# EAGLE design i2c (EAGLE 6.1)
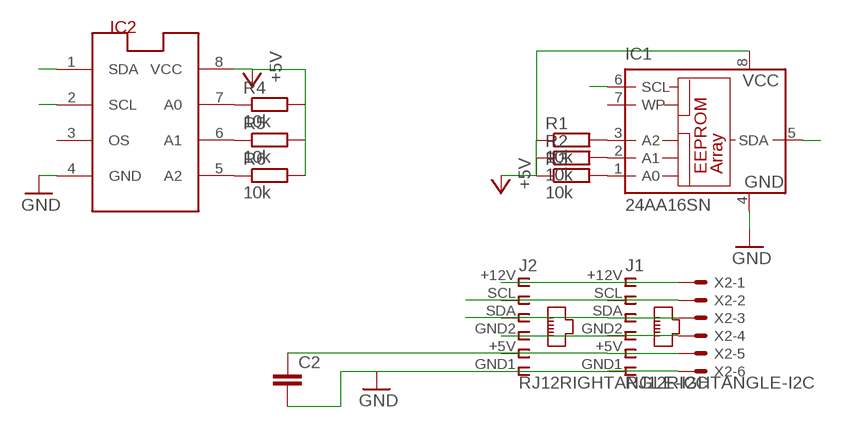
[diagram p0: schematic, sheet 1]

## Parts
C2  C-EUC1206  [C1206]
IC1  24AA16SN  [SO-08]
IC2  LM75_ICN  [SO8_LM75]
J1  RJ12RIGHTANGLE-I2C  [RJ12-RIGHTANGLE-I2C]
J2  RJ12RIGHTANGLE-I2C  [RJ12-RIGHTANGLE-I2C]
R1  10k  R-EU_M1206  [M1206]
R2  10k  R-EU_M1206  [M1206]
R3  10k  R-EU_M1206  [M1206]
R4  10k  R-EU_M1206  [M1206]
R5  10k  R-EU_M1206  [M1206]
R6  10k  R-EU_M1206  [M1206]
X2  KK-156-6  [KK-156-6]

## Nets
+5V: IC1.8(VCC) IC2.8(VCC) R1.1 R2.1 R3.1 R4.2 R5.2 R6.2
GND: C2.2 IC1.4(GND) IC2.4(GND) J1.GND1 J2.GND1 X2.6
N$1: J1.+12V J2.+12V X2.1
N$2: IC1.1(A0) R3.2
N$3: J1.GND2 J2.GND2 X2.4
N$4: IC1.2(A1) R2.2
N$5: IC1.3(A2) R1.2
N$6: IC2.1(SDA)
N$7: IC2.2(SCL)
N$8: IC2.5(A2) R6.1
N$10: IC2.7(A0) R4.1
N$11: IC2.6(A1) R5.1
SCL: IC1.6(SCL) J1.SCL J2.SCL X2.2
SDA: IC1.5(SDA) J1.SDA J2.SDA X2.3
VCC: C2.1 J1.+5V J2.+5V X2.5
Unconnected: IC1.7(WP) IC2.3(OS)

## Library data of the parts
C2 = rcl:C-EU: CAPACITOR, European symbol
IC1 = microchip:24*: Serial EEPROM I2C; MF: MICROCHIP; MPN: 24AA16-I/SN; OC_FARNELL: 1331289; OC_NEWARK: 96K4056
IC2 = lm75:LM75_IC: Temperatursensor
J1 J2 = lpatiny:RJ12: CORCOM Modular RJ Jacks No Shield Source: www.tycoelectronics.com .. ENG_DS_1654001_1099_RJ_L_0507.pdf
R1-R6 = resistor:R-EU_: RESISTOR, European symbol
X2 = con-molex:KK-156-6: KK 156 HEADER Source: http://www.molex.com/pdm_docs/sd/026604100_sd.pdf; OC_FARNELL: unknown; OC_NEWARK: unknown

## Net classes
0 default: width 0.508 mm

## Board
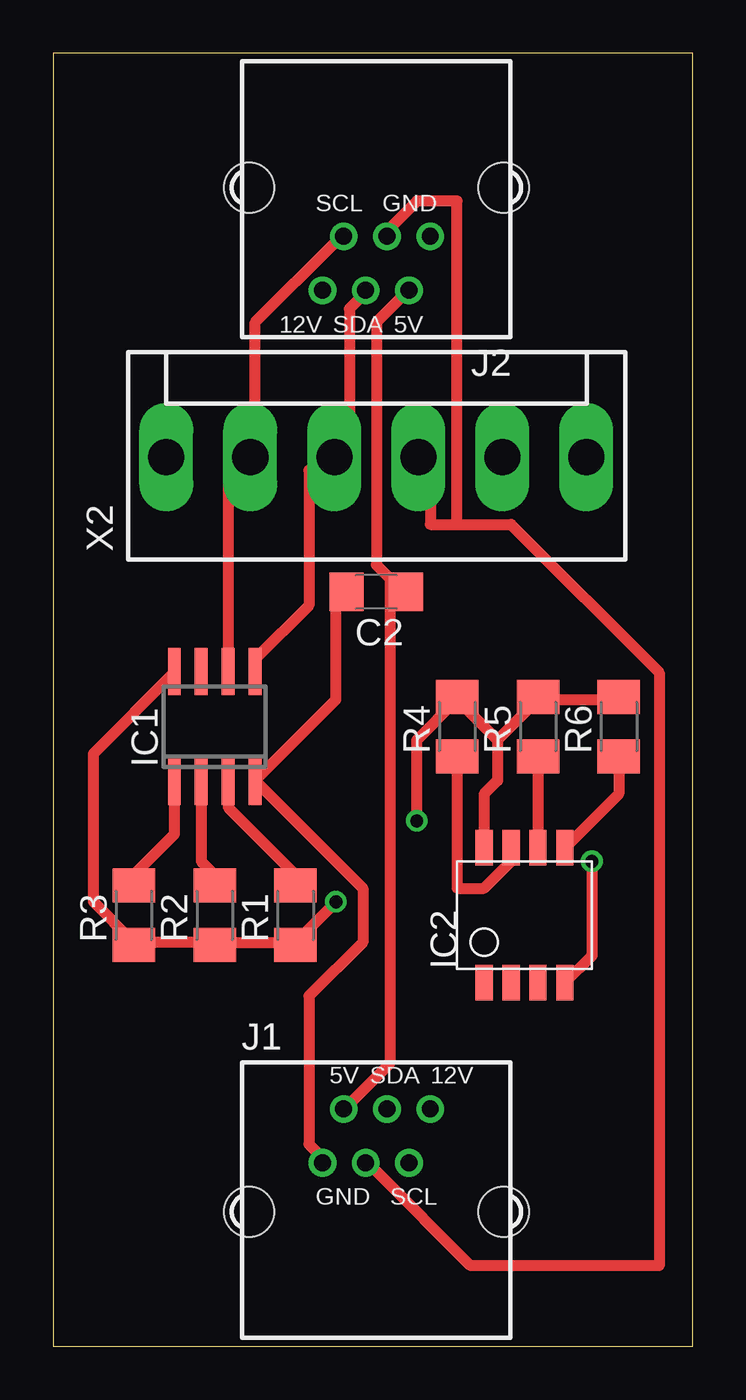
[diagram p1: board, top side]
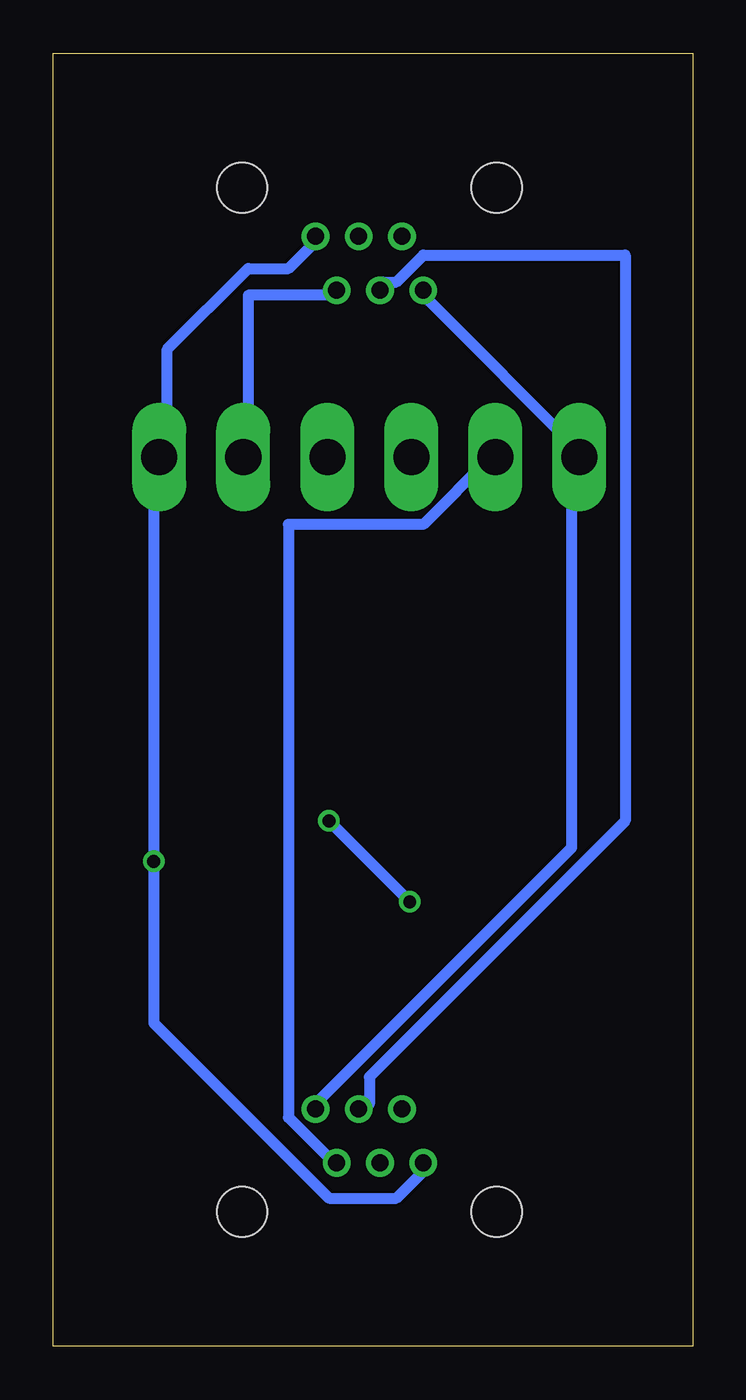
[diagram p2: board, bottom side, seen from below]

Size 30.15 x 60.95 mm. Coordinates in mm from the lower left corner, seen from the top.
Outline: 0,0 30.15,0 30.15,60.95 0,60.95 0,0
Copper layers (1*16): Top 0.035mm / dielectric 1.5mm / Bottom 0.035mm
Design rules: minimum track width 10mil, minimum drill 24mil, track to track 8mil, track to pad 8mil, pad to pad 8mil, via to via 8mil, smd to smd 8mil, copper to edge 40mil, drill to drill 8mil, minimum pad ring 10mil, minimum via ring 8mil, stop-mask expansion 4mil, vias tented up to drill 0mil, thermal gap 10mil

### Footprints (pad centres in the part's own frame; a part is rotated, then mirrored left to right if it is on the bottom)
C1206 = smd 1.6 x 1.8: 1 -1.4,0; 2 1.4,0
SO-08 = smd 0.6 x 2.2: 1 -1.905,-2.6; 2 -0.635,-2.6; 3 0.635,-2.6; 4 1.905,-2.6; 5 1.905,2.6; 6 0.635,2.6; 7 -0.635,2.6; 8 -1.905,2.6
SO8_LM75 = smd 0.813 x 1.676: 1 -1.27,-3.175; 2 0,-3.175; 3 1.27,-3.175; 4 2.54,-3.175; 5 2.54,3.175; 6 1.27,3.175; 7 0,3.175; 8 -1.27,3.175
RJ12-RIGHTANGLE-I2C = drill 0.8 pad 1.3: +5V -1.54,4.84; +12V 2.54,4.84; GND1 -2.54,2.3; GND2 -0.5,2.3; SCL 1.54,2.3; SDA 0.5,4.84 | hole 2.36: -6,0; 6,0
M1206 = smd 1.6 x 2: 1 -1.4,0; 2 1.4,0
KK-156-6 = drill 1.7 pad 2.184 long: 1 -9.9,0; 2 -5.94,0; 3 -1.98,0; 4 1.98,0; 5 5.94,0; 6 9.9,0

### Placement (x,y rotation side)
C2  15.24,35.56 180 top
IC1  7.62,29.21 0 top
IC2  21.59,20.32 0 top
J1  15.24,6.35 0 top
J2  15.24,54.61 180 top
R1  11.43,20.32 90 top
R2  7.62,20.32 90 top
R3  3.81,20.32 90 top
R4  19.05,29.21 90 top
R5  22.86,29.21 90 top
R6  26.67,29.21 90 top
X2  15.24,41.91 0 top

### Tracks (layer width: path | path; a pad name or v marks a point on that pad's centre or on a via)
+5V  (via drill 0.61)
  Top 0.508: IC2.8 20.32,26.04 20.95,26.67 20.95,28.57 | 19.05,30.48 20.95,28.57 | 20.95,28.57 22.86,30.48 | 22.86,30.48 26.67,30.48 R6.2 | 22.86,30.48 R5.2 | 7.62,19.05 3.81,19.05 | 7.62,19.05 11.43,19.05 | 7.62,19.05 R2.1 | 3.81,19.05 1.91,20.95 1.91,27.94 5.71,31.75 IC1.8 | 3.81,19.05 R3.1 | 19.05,30.48 17.14,28.57 v17.14,24.77 | 11.43,19.05 v13.34,20.95 | 19.05,30.48 R4.2 | 11.43,19.05 R1.1
  Bottom 0.508: v13.34,20.95 v17.14,24.77
GND  (via drill 0.61)
  Top 0.508: 9.53,26.67 13.34,30.48 13.34,35.56 C2.2 | 9.53,26.67 14.61,21.59 14.61,19.05 12.06,16.51 12.06,9.53 12.7,8.89 J1.GND1 | 9.53,26.67 IC1.4 | IC2.4 25.4,18.41 v25.4,22.86
  Bottom 0.508: J2.GND1 17.78,52.07 19.05,50.8 20.95,50.8 24.77,46.99 24.77,41.91 X2.6 25.4,41.91 v25.4,22.86 25.4,15.24 17.14,6.99 13.97,6.99 12.7,8.26 J1.GND1
N$1
  Bottom 0.508: J1.+12V 17.78,11.43 5.71,23.5 5.71,41.91 X2.1 5.08,41.91 12.7,49.53 J2.+12V
N$2
  Top 0.508: IC1.1 5.71,24.13 3.81,22.23 R3.2
N$3
  Top 0.508: 19.05,38.73 17.78,38.73 17.78,41.91 X2.4 | 19.05,38.73 21.59,38.73 28.57,31.75 28.57,3.81 19.68,3.81 15.24,8.26 J1.GND2 | 19.05,38.73 19.05,53.98 17.14,53.98 15.88,52.7 J2.GND2
N$4
  Top 0.508: IC1.2 6.99,22.86 7.62,22.23 R2.2
N$5
  Top 0.508: IC1.3 8.26,25.4 11.43,22.23 R1.2
N$8
  Top 0.508: IC2.5 26.67,26.04 R6.1
N$10
  Top 0.508: IC2.7 21.59,22.86 20.32,21.59 19.05,21.59 R4.1
N$11
  Top 0.508: R5.1 IC2.6
SCL
  Top 0.508: IC1.6 8.26,41.27 8.89,41.91 X2.2 9.53,41.91 9.53,48.26 13.34,52.07 J2.SCL
  Bottom 0.508: J1.SCL 17.14,8.89 19.05,10.79 19.05,38.73 12.7,38.73 9.53,41.91 X2.2
SDA
  Top 0.508: IC1.5 9.53,32.38 12.06,34.92 12.06,41.27 12.7,41.91 X2.3 13.34,41.91 13.97,42.55 13.97,48.9 14.61,49.53 J2.SDA
  Bottom 0.508: J1.SDA 15.24,11.43 15.24,12.7 3.17,24.77 3.17,51.44 12.7,51.44 13.97,50.16 14.61,50.16 J2.SDA
VCC
  Top 0.508: 15.88,36.2 15.24,36.83 15.24,48.26 16.51,49.53 J2.+5V | 15.88,36.2 16.51,35.56 C2.1 15.88,36.2 | 15.88,36.2 15.88,13.34 13.97,11.43 J1.+5V
  Bottom 0.508: X2.5 20.95,41.91 20.95,49.53 17.14,49.53 J2.+5V